# Altium schematic sheet BSE_SCH.SchDoc
size A
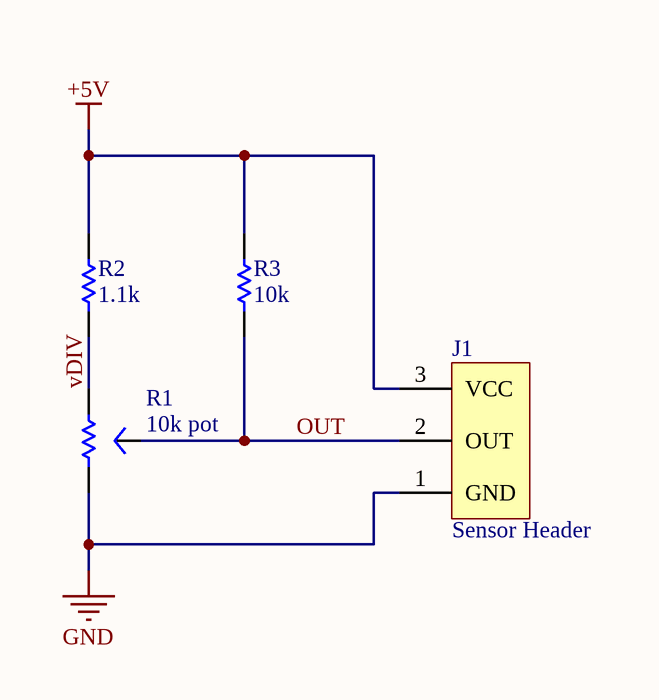
[diagram p0: BSE_SCH.SchDoc]

## Parts
J1  Sensor Header  [Header3POS-SMD]
R1  10k pot  [10k Rotary Encoder]
R2  1.1k  [RES 0603]
R3  10k  [RES 0603]

## Nets
+5V: J1.3(VCC) R2.2 R3.2
GND: J1.1(GND) R1.1
OUT: J1.2(OUT) R1.2 R3.1
vDIV: R1.3 R2.1

## Library data of the parts
J1 = Header3POS-SMD: Conn Shrouded Header (4 Sides) HDR 3 POS 1.5mm Solder RA SMD Pico-SPOX™ T/R; Manufacturer: Molex; Manufacturer Part Number: 0874380343; Contact Resistance: 40mR; Number of Positions: 3; Max Voltage Rating (AC): 350V; Connector Type: Male Pin; Supplier 1: Digi-Key; Stock 1: 3095; Pricing 1: 1=0.6, 10=0.561, 100=0.4304, 500=0.37422 (USD); Mount: Surface Mount; Contact Plating: Tin; Color: Beige; Contact Material: Brass; Housing Color: Natural; Housing Material: Thermoplastic; Min Operating Temperature: -55°C; Max Operating Temperature: 105°C; Packaging: Tape and Reel; Number of Rows: 1; Termination: Solder; Number of Contacts: 3; Orientation: Right Angle; Length: 5.8mm; Pitch: 1.5mm; Contact Mating Length: 0.106inch; Depth: 5.75mm; Radiation Hardening: No; ComponentLink1URL: http://www.molex.com/webdocs/datasheets/pdf/en-us/0874380343_PCB_HEADERS.pdf?src-supplier=Avnet; ComponentLink1Description: http://www.molex.com/webdocs/datasheets/pdf/en-us/0874380343_PCB_HEADERS.pdf?src-supplier=Avnet; ComponentLink2URL: http://rhu004.sma-promail.com/SQLImages/kelmscott/Molex/PDF_Images/USA-235.pdf?src-supplier=Digi-Key; ComponentLink2Description: http://rhu004.sma-promail.com/SQLImages/kelmscott/Molex/PDF_Images/USA-235.pdf?src-supplier=Digi-Key; Supplier Part Number 1: WM7647CT-ND
R1 = 10k rotary encoder: Res Cermet Trimmer 10K Ohm 30% 1(Elec)/1(Mech)Turn 4mm (11 X 14.9 X 3.1mm) Gull Wing SMD T/R; Manufacturer: Murata; Manufacturer Part Number: SV01A103AEA01R00; Resistance: 10kR; Number of Turns: 1; Linearity: 2%; Temperature Coefficient: 500ppm/°C; Sensing Method: Resistive; Actuator Type: Hole for Shaft; Supplier 1: Digi-Key; Stock 1: 998; Pricing 1: 1=2.46, 5=2.328, 10=1.995, 25=1.596, 50=1.4628, 100=1.3299, 500=1.16366 (USD); Mount: Surface Mount; Case/Package: SMD/SMT; Min Operating Temperature: -40°C; Max Operating Temperature: 85°C; Packaging: Tape and Reel; Package Quantity: 1000; Tolerance: 30%; Termination: Gull Wing; Military Standard: Not; Type: Potentiometer; Length: 11mm; Height: 2.1mm; Depth: 14.9mm; Lead Free: Lead Free; ComponentLink1URL: http://www1.futureelectronics.com/doc/MURATA/SV01A103AEA01R00.pdf?src-supplier=Future+Electronics; ComponentLink1Description: http://www1.futureelectronics.com/doc/MURATA/SV01A103AEA01R00.pdf?src-supplier=Future+Electronics; ComponentLink2URL: https://www.murata.com/en-us/products/productdata/8796781117470/S0070E.pdf?src-supplier=Digi-Key; ComponentLink2Description: https://www.murata.com/en-us/products/productdata/8796781117470/S0070E.pdf?src-supplier=Digi-Key; ComponentLink3URL: http://www.murata.com/~/media/webrenewal/support/library/catalog/products/sensor/rotaryposition/r51e.ashx?src-supplier=Digi-Key; ComponentLink3Description: http://www.murata.com/~/media/webrenewal/support/library/catalog/products/sensor/rotaryposition/r51e.ashx?src-supplier=Digi-Key; ComponentLink4URL: http://uk.rs-online.com/webdocs/13ec/0900766b813ecb07.pdf?src-supplier=RSComponents; ComponentLink4Description: http://uk.rs-online.com/webdocs/13ec/0900766b813ecb07.pdf?src-supplier=RSComponents; Supplier Part Number 1: 490-7023-1-ND
R2 = RES 1.1k: ERJPA3 Resistors 0.25W 0603 1K1 1%; Manufacturer: Panasonic; Manufacturer Part Number: ERJ-PA3F1101V; Resistance: 1.1kR; Power Rating: 250mW; Voltage Rating: 150V; Temperature Coefficient: 100ppm/°C; Supplier 1: Digi-Key; Stock 1: 10551; Pricing 1: 1=0.13, 10=0.12, 100=0.0461, 1000=0.02028, 2500=0.01752 (USD); Mount: Surface Mount; Case/Package: 0603; Case Code (Metric): 1608; Case Code (Imperial): 0603; Min Operating Temperature: -55°C; Max Operating Temperature: 155°C; Tolerance: 1%; Packaging: Cut Tape; Composition: Thick Film; Number of Terminations: 2; Termination: Solder; Max Power Dissipation: 250mW; Voltage Rating (DC): 150V; Features: Automotive AEC-Q200; Length: 0.063inch; Height: 0.018inch; Width: 0.031inch; Depth: 0.8mm; REACH SVHC: No SVHC; ComponentLink1URL: http://www.farnell.com/datasheets/1801181.pdf?src-supplier=Element14; ComponentLink1Description: http://www.farnell.com/datasheets/1801181.pdf?src-supplier=Element14; ComponentLink2URL: http://industrial.panasonic.com/cdbs/www-data/pdf/RDO0000/AOA0000C331.pdf?src-supplier=Farnell; ComponentLink2Description: http://industrial.panasonic.com/cdbs/www-data/pdf/RDO0000/AOA0000C331.pdf?src-supplier=Farnell; Supplier Part Number 1: P1.1KBYCT-ND
R3 = RES 10k: RES SMD 10K OHM 1% 1/4W 0603; Manufacturer: Rohm; Manufacturer Part Number: ESR03EZPF1002; Resistance: 10kR; Power Rating: 250mW; Temperature Coefficient: 100ppm/°C; Supplier 1: Digi-Key; Stock 1: 195314; Pricing 1: 1=0.12, 10=0.11, 100=0.0424, 1000=0.01866, 2500=0.01611 (USD); Case/Package: 0603; Case Code (Metric): 1608; Case Code (Imperial): 0603; Min Operating Temperature: -55°C; Max Operating Temperature: 155°C; Tolerance: 1%; Package Quantity: 1; Packaging: Tape and Reel; Composition: Thick Film; Number of Terminations: 2; Max Power Dissipation: 250mW; Features: Automotive AEC-Q200; Length: 0.063inch; Height: 0.022inch; Width: 0.031inch; Lead Free: Lead Free; ComponentLink1URL: https://www.rohm.com/datasheet/ESR01MZPF/esr-e?src-supplier=Digi-Key; ComponentLink1Description: https://www.rohm.com/datasheet/ESR01MZPF/esr-e?src-supplier=Digi-Key; Supplier Part Number 1: RHM10KADCT-ND